# Altium project IR Sensor.PrjPcb
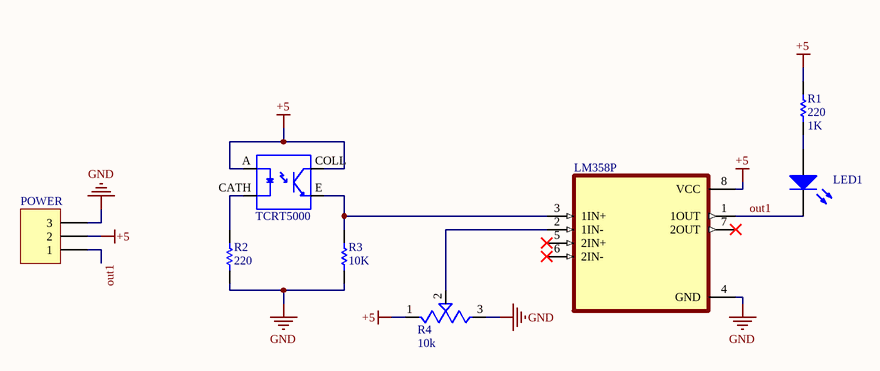
[diagram p0: Sheet1.SchDoc]
1 sheet, 8 parts. Net scope: global (net labels, ports and power ports of the same name join across sheets).
Board file: PCB1.PcbDoc

## Sheet Sheet1.SchDoc
size A; SheetNumber: 1; SheetTotal: 1

### Parts
LED1  151031SS06000  [WL-TIRW_D3.9H5.3]  (value not drawn)
LM358P  (no value)  [DIP794W45P254L959H508Q8]
POWER  (no value)  [HDR1X3]
R1  220  value 1K  [AXIAL-0.3]
R2  220  [AXIAL-0.3]
R3  10K  [AXIAL-0.3]
R4  10k  [TRIM_3306F-1-203]
TCRT5000  (no value)  [OPTO_TCRT5000]

### Nets
+5: LM358P.8(VCC) POWER.2 R1.2 R4.1(CCW) TCRT5000.A TCRT5000.COLL
GND: LM358P.4(GND) POWER.3 R2.1 R3.1 R4.3(CW)
out1: LED1.1(K) LM358P.1(1OUT) POWER.1
NetLED1_2: LED1.2(A) R1.1
NetLM358P_2: LM358P.2(1IN-) R4.2(W)
NetLM358P_3: LM358P.3(1IN+) R3.2 TCRT5000.E
NetR2_2: R2.2 TCRT5000.CATH

Not connected (* = marked no-connect by the designer): LM358P 5(2IN+)* 6(2IN-)* 7(2OUT)*

### Library data of the parts
LED1 = CMP-1488-00002-1: THT LED round mono-color color lens, WL-TMRW, Super Red; Manufacturer: Wuerth Elektronik; ComponentLink2URL: http://katalog.we-online.de/pbs/datasheet/7448042001.pdfhttp://katalog.we-online.de/pbs/datasheet/7448042001.pdfhttp://katalog.we-online.de/pbs/datasheet/7448042001.pdfhttp://katalog.we-online.de/pbs/datasheet/151031SS06000.pdf; ComponentLink1URL: http://www.we-online.com; PartNumber: 151031SS06000; ComponentLink2Description: Datasheet; PackageReference: Type 3mm; Emitting color: Super Red; ComponentLink1Description: Manufacturer URL
LM358P = LM358P: Dual Operational Amplifiers; MF: Texas Instruments; Package: PDIP-8 Texas Instruments; DigiKey-Purchase-URL: https://snapeda.com/shop?store=DigiKey&id=559457; MP: LM358P; Arrow_Electronics-Purchase-URL: https://snapeda.com/shop?store=Arrow+Electronics&id=559457; Price: None; Texas_Instruments-Purchase-URL: https://snapeda.com/shop?store=Texas+Instruments&id=559457; Value: *; Availability: Unavailable; SnapEDA_Link: https://www.snapeda.com/parts/LM358P/Texas%20Instruments/view-part/559457/?ref=snap; Mouser-Purchase-URL: https://snapeda.com/shop?store=Mouser&id=559457
POWER = Header 3: Header, 3-Pin; LatestRevisionDate: 17-Jul-2002; LatestRevisionNote: Re-released for DXP Platform.; Publisher: Altium Limited
R1-R3 = Res1: Resistor; Published: 8-Jun-2000; LatestRevisionDate: 17-Jul-2002; LatestRevisionNote: Re-released for DXP Platform.; PackageReference: AXIAL-0.3; Publisher: Altium Limited; PackageDescription: Axial Device, Thru-Hole; 2 Leads; 0.3 in Pin Spacing
R4 = 3306F-1-203: 20 kOhms 0.2W; MF: Bourns; Price: None; Value: *; MP: 3306F-1-203; Package: 6432 Bourns; Purchase-URL: https://pricing.snapeda.com/search/part/3306F-1-203/?ref=eda; SnapEDA_Link: https://www.snapeda.com/parts/3306F-1-203/Bourns/view-part/1444258/?ref=snap; Availability: Good
TCRT5000 = TCRT5000: Reflective Optical Sensor 0.591 _15mm_ PCB Mount; MF: Vishay; Package: PCB Mount Vishay; Value: *; Price: None; MP: TCRT5000; SnapEDA_Link: https://www.snapeda.com/parts/TCRT5000/Vishay%20Semiconductor%20Opto%20Division/view-part/885229/?ref=snap; Availability: Unavailable